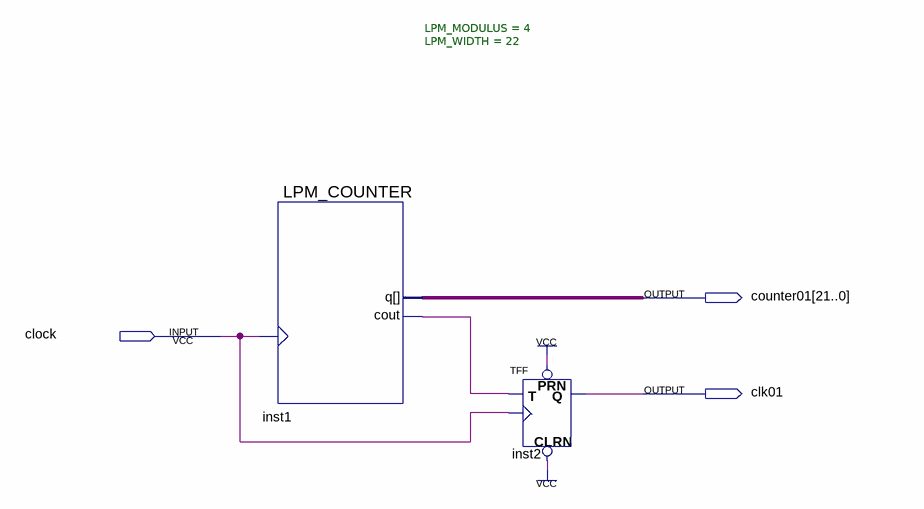
[diagram p0: schematic sheet]
// Quartus schematic lpm01.bdf as structural Verilog: 2 symbols, 3 pins
module lpm01 (
  input  clock,
  output [21:0] counter01,
  output clk01
);

  wire inst1_cout;

  LPM_COUNTER #(.LPM_MODULUS(4), .LPM_WIDTH(22)) inst1 (.clock(clock), .cout(inst1_cout), .q(counter01));
  TFF inst2 (.PRN(1'b1), .CLRN(1'b1), .T(inst1_cout), .CLK(clock), .Q(clk01));
endmodule
